# Altium schematic sheet schematic.SchDoc
size A4; SheetNumber: 6; SheetTotal: 29
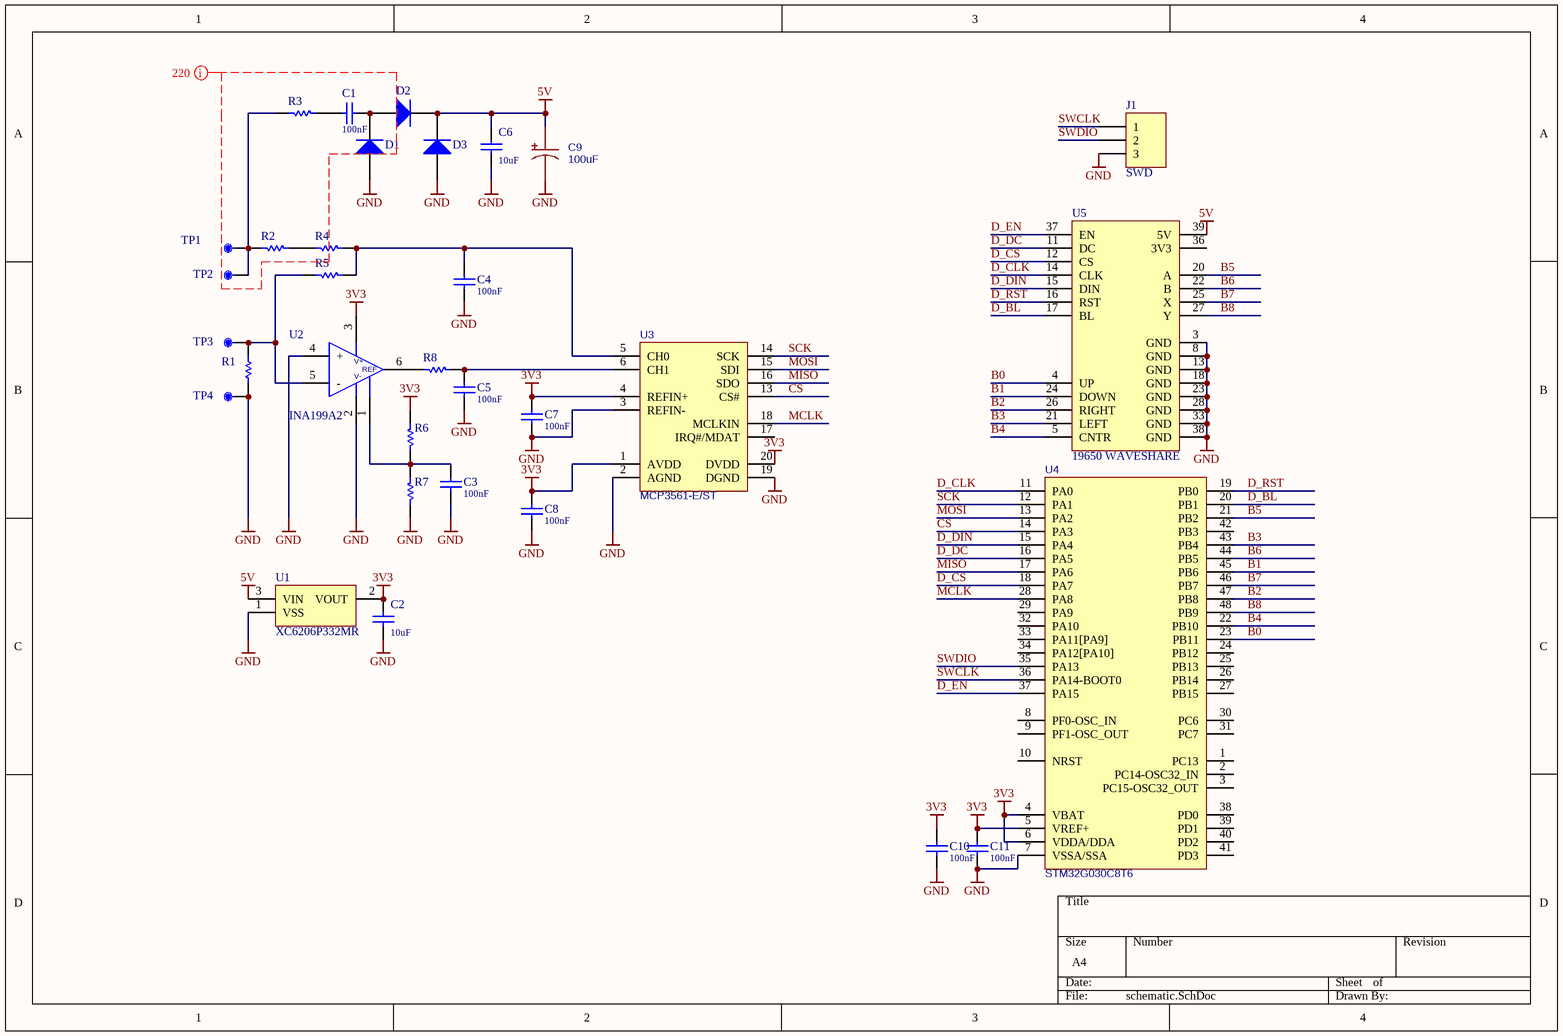
[diagram p0: schematic.SchDoc]

## Parts
C1  100nF  [CAP-TH_27,5]
C2  10uF  [C1206]
C3  100nF  [C0402]
C4  100nF  [C0402]
C5  100nF  [C0402]
C6  10uF  [C1206]
C7  100nF  [C0402]
C8  100nF  [C0402]
C9  100uF  [C7343]
C10  100nF  [C0402]
C11  100nF  [C0402]
D1  (no value)  [DO-41]
D2  (no value)  [DO-41]
D3  (no value)  [SMA]
J1  SWD  [HDR-1X3]  (no BOM)
R1  (no value)  [R2512-WIDE]
R2  (no value)  [R1206]
R3  (no value)  [RES-TH_20]
R4  (no value)  [R1206]
R5  (no value)  [R1206]
R6  (no value)  [R0603]
R7  (no value)  [R0603]
R8  (no value)  [R0603]
TP1  (no value)  [TP2030_SMD]  (no BOM)
TP2  (no value)  [TP2030_SMD]  (no BOM)
TP3  (no value)  [TP2030_SMD]  (no BOM)
TP4  (no value)  [TP2030_SMD]  (no BOM)
U1  XC6206P332MR  [SOT-23]
U2  INA199A2  [SOT-363]
U3  MCP3561-E/ST  [SSOP-20]
U4  STM32G030C8T6  [LQFP-48]
U5  19650 WAVESHARE  [DISP_19650_WS]

## Nets
3V3: C2.2 C7.2 C8.2 C10.2 C11.2 R6.2 U1.2(VOUT) U2.3(V+) U3.1(AVDD) U3.4(REFIN+) U3.20(DVDD) U4.4(VBAT) U4.5(VREF+) U4.6(VDDA/DDA)
5V: C6.2 C9.1 D2.2(K) D3.2(K) U1.3(VIN) U5.39(5V)
GND: C2.1 C3.1 C4.1 C5.1 C6.1 C7.1 C8.1 C9.2 C10.1 C11.1 D1.1(A) D3.1(A) J1.3 R1.2 R7.1 TP4.1 U1.1(VSS) U2.2(GND) U2.4(+) U3.2(AGND) U3.3(REFIN-) U3.19(DGND) U4.7(VSSA/SSA) U5.3(GND) U5.8(GND) U5.13(GND) U5.18(GND) U5.23(GND) U5.28(GND) U5.33(GND) U5.38(GND)
B0: U4.23(PB11) U5.4(UP)
B1: U4.45(PB6) U5.24(DOWN)
B2: U4.47(PB8) U5.26(RIGHT)
B3: U4.43(PB4) U5.21(LEFT)
B4: U4.22(PB10) U5.5(CNTR)
B5: U4.21(PB2) U5.20(A)
B6: U4.44(PB5) U5.22(B)
B7: U4.46(PB7) U5.25(X)
B8: U4.48(PB9) U5.27(Y)
CS: U3.13(CS#) U4.14(PA3)
D_BL: U4.20(PB1) U5.17(BL)
D_CLK: U4.11(PA0) U5.14(CLK)
D_CS: U4.18(PA7) U5.12(CS)
D_DC: U4.16(PA5) U5.11(DC)
D_DIN: U4.15(PA4) U5.15(DIN)
D_EN: U4.37(PA15) U5.37(EN)
D_RST: U4.19(PB0) U5.16(RST)
MCLK: U3.18(MCLKIN) U4.28(PA8)
MISO: U3.16(SDO) U4.17(PA6)
MOSI: U3.15(SDI) U4.13(PA2)
SCK: U3.14(SCK) U4.12(PA1)
SWCLK: J1.1 U4.36(PA14-BOOT0)
SWDIO: J1.2 U4.35(PA13)
NetC1_1: C1.1 D1.2(K) D2.1(A)
NetC1_2: C1.2 R3.1
NetC3_2: C3.2 R6.1 R7.2 U2.1(REF)
NetC4_2: C4.2 R4.1 R5.2 U3.5(CH0)
NetC5_2: C5.2 R8.1 U3.6(CH1)
NetR1_1: R1.1 R5.1 TP3.1 U2.5(-)
NetR2_1: R2.1 R4.2
NetR2_2: R2.2 R3.2 TP1.1 TP2.1
NetR8_2: R8.2 U2.6(OUT)

Not connected (* = marked no-connect by the designer): U3 17(IRQ#/MDAT); U4 1(PC13) 2(PC14-OSC32_IN) 3(PC15-OSC32_OUT) 8(PF0-OSC_IN) 9(PF1-OSC_OUT) 10(NRST) 24(PB12) 25(PB13) 26(PB14) 27(PB15) 29(PA9) 30(PC6) 31(PC7) 32(PA10) 33(PA11[PA9]) 34(PA12[PA10]) 38(PD0) 39(PD1) 40(PD2) 41(PD3) 42(PB3); U5 36(3V3)

## Layout directives
net class 220: GND

## Notes on the sheet
- (in symbol MCP65R41T-2402) V-

## Library data of the parts
C1-C8 C10 C11 = CAP
C9 = 220uF
D1-D3 = US1M-13-F
J1 = Header 3
R1-R8 = RES
TP1-TP4 = TP_Dup1
U1 = Component_4_1
U2 = MCP65R41T-2402